# Altium schematic sheet C-07 PWR MGR.SchDoc
size 513 x 386 mm
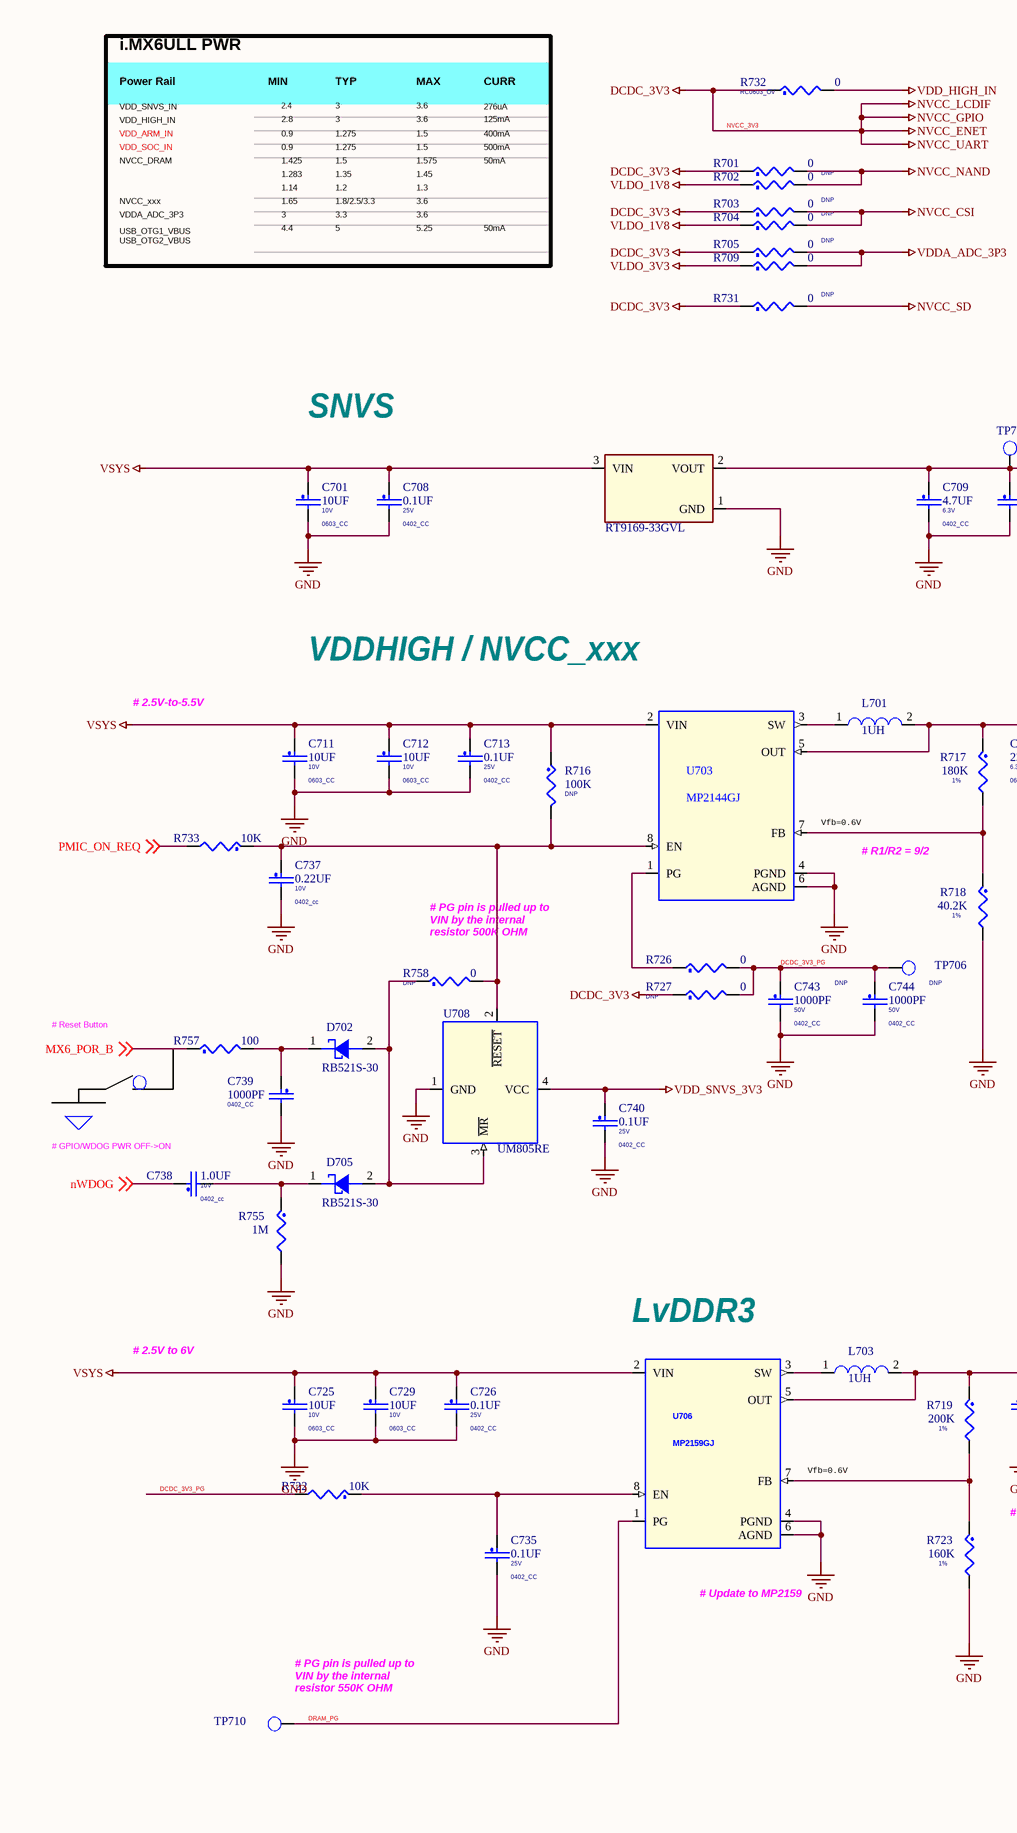
[diagram p0: C-07 PWR MGR.SchDoc, left]
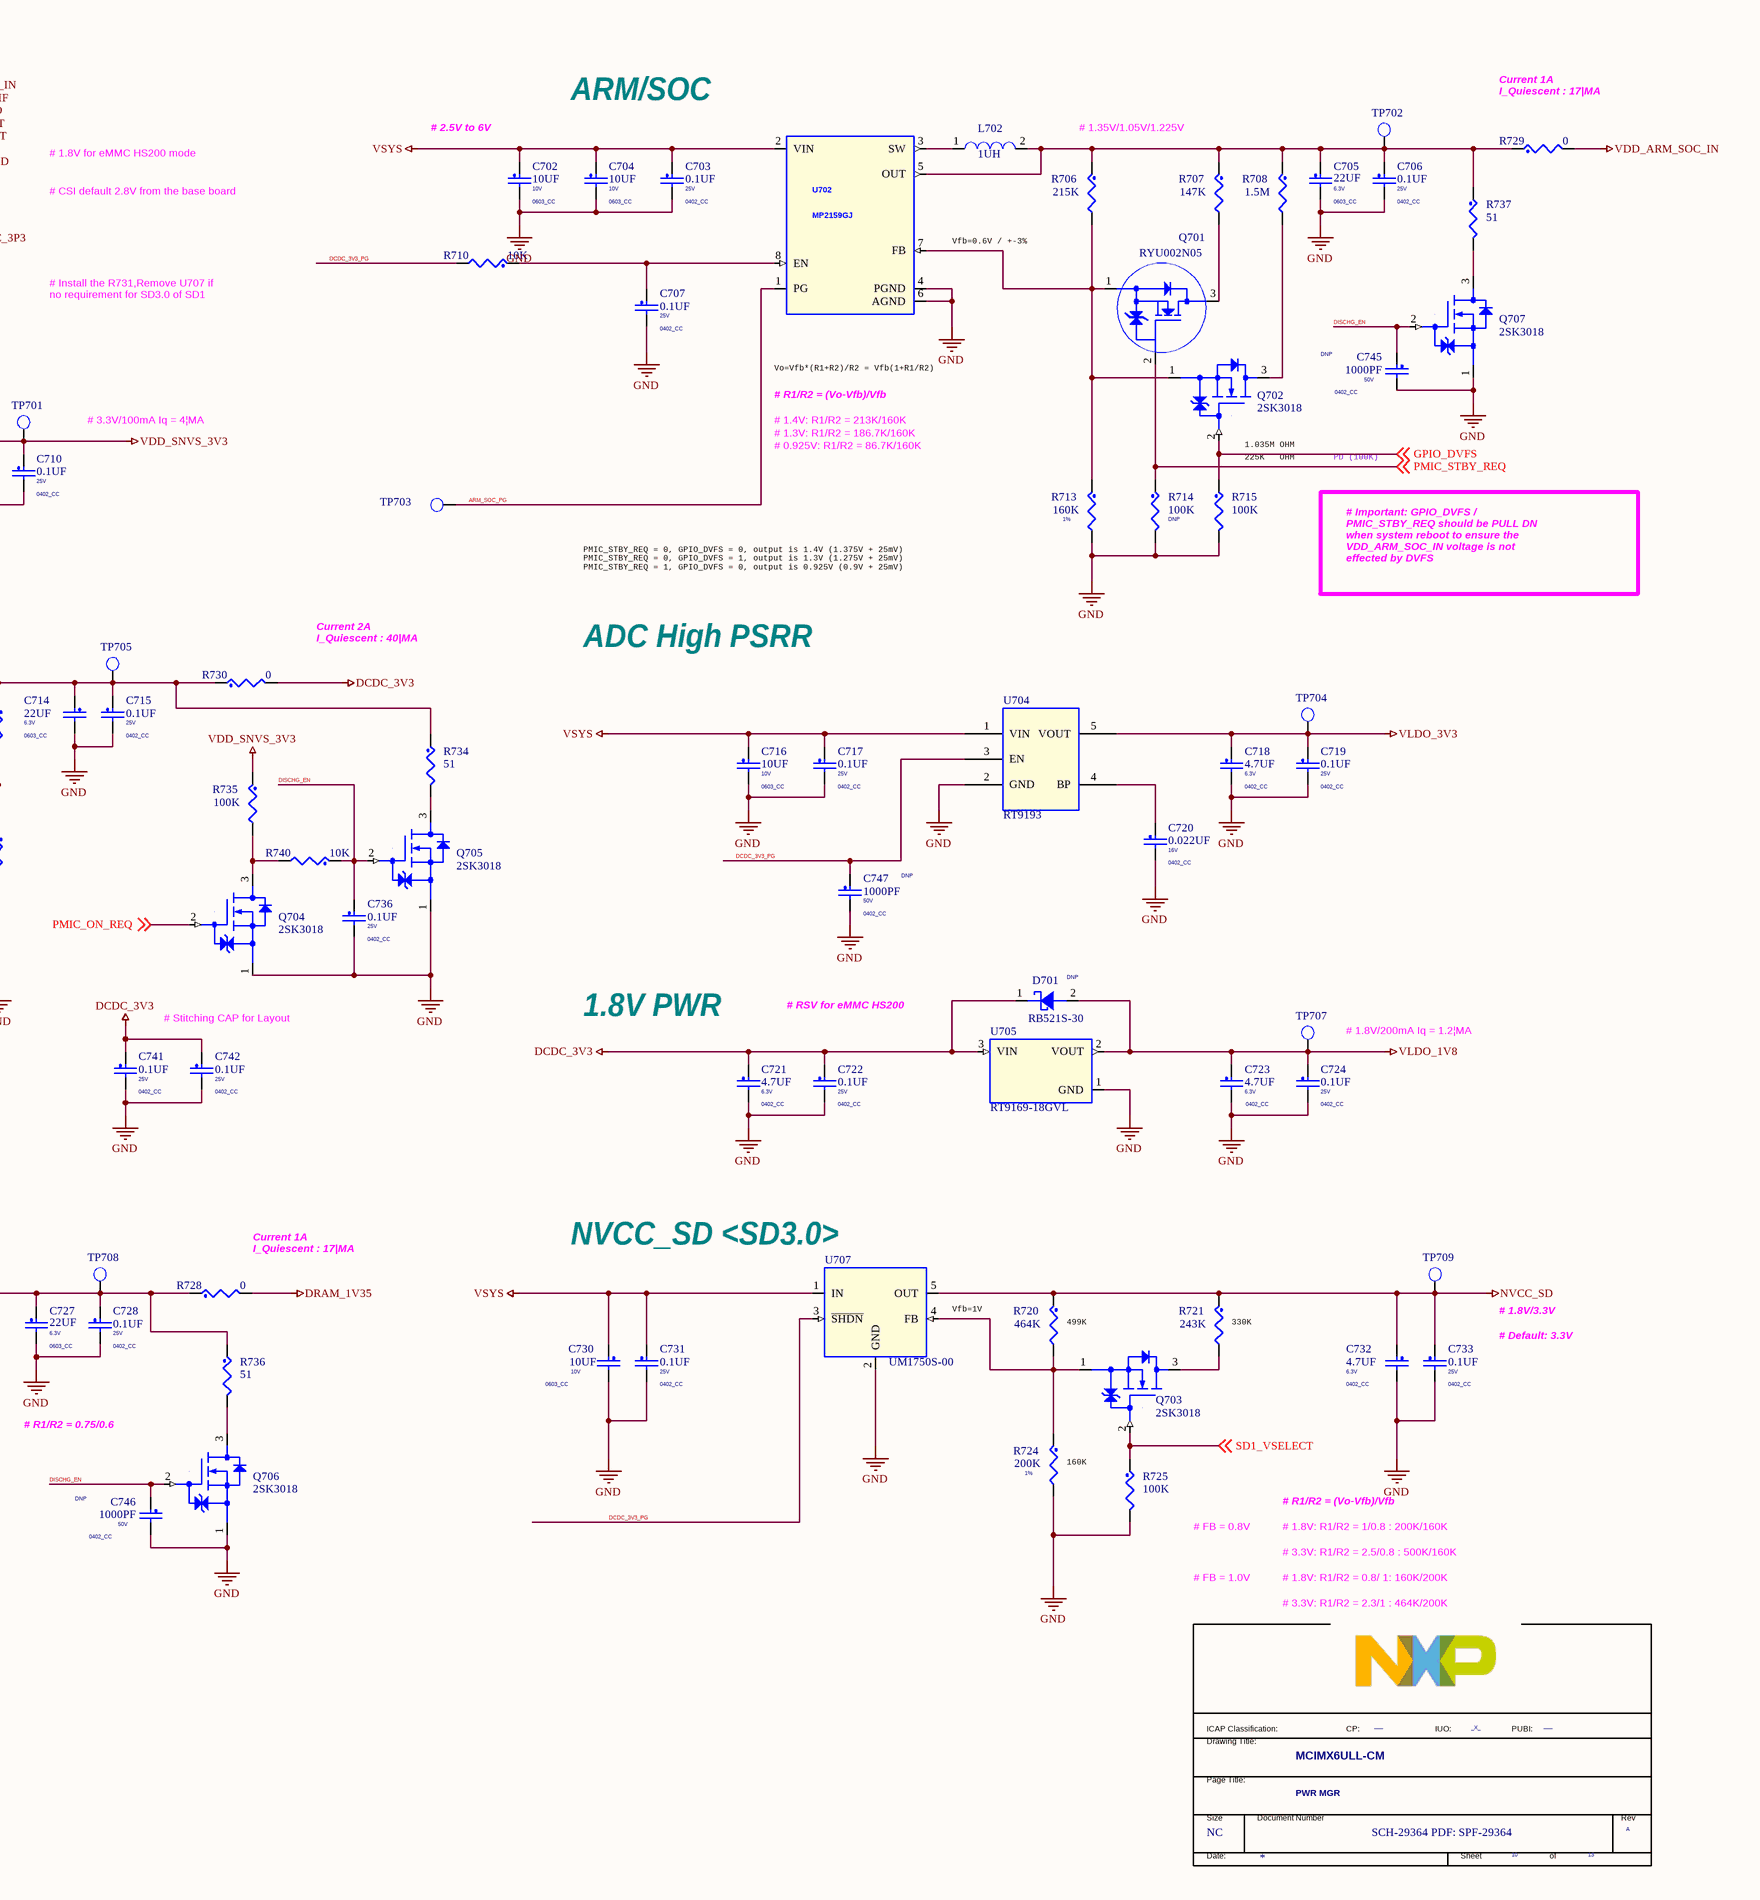
[diagram p1: C-07 PWR MGR.SchDoc, right]

## Parts
*  FIUO: _X_  PUBI: ___  Doc: SCH-29364 PDF: SPF-29364  RevCode: A  Title: MCIMX6ULL-CM  Page Size: NC  Page Number: 10  Page Count: 13  PageTitle: PWR MGR  (hidden comment: TitleBlock_FS)  (graphical)
C701  10UF  PCB Footprint: 0603_CC  VOLTAGE: 10V  [C0603_H0.8mm]
C702  10UF  PCB Footprint: 0603_CC  VOLTAGE: 10V  [C0603_H0.8mm]
C703  0.1UF  PCB Footprint: 0402_CC  VOLTAGE: 25V  [C0402_H0.5mm]
C704  10UF  PCB Footprint: 0603_CC  VOLTAGE: 10V  [C0603_H0.8mm]
C705  22UF  voltage rating: 6.3V  PCB Footprint: 0603_CC  [C0603_H0.8mm]
C706  0.1UF  PCB Footprint: 0402_CC  VOLTAGE: 25V  [C0402_H0.5mm]
C707  0.1UF  PCB Footprint: 0402_CC  VOLTAGE: 25V  [C0402_H0.5mm]
C708  0.1UF  PCB Footprint: 0402_CC  VOLTAGE: 25V  [C0402_H0.5mm]
C709  4.7UF  voltage rating: 6.3V  PCB Footprint: 0402_CC  [C0402_H0.5mm]
C710  0.1UF  PCB Footprint: 0402_CC  VOLTAGE: 25V  [C0402_H0.5mm]
C711  10UF  PCB Footprint: 0603_CC  VOLTAGE: 10V  [C0603_H0.8mm]
C712  10UF  PCB Footprint: 0603_CC  VOLTAGE: 10V  [C0603_H0.8mm]
C713  0.1UF  PCB Footprint: 0402_CC  VOLTAGE: 25V  [C0402_H0.5mm]
C714  22UF  PCB Footprint: 0603_CC  voltage rating: 6.3V  [C0603_H0.8mm]
C715  0.1UF  PCB Footprint: 0402_CC  VOLTAGE: 25V  [C0402_H0.5mm]
C716  10UF  PCB Footprint: 0603_CC  VOLTAGE: 10V  [C0603_H0.8mm]
C717  0.1UF  PCB Footprint: 0402_CC  VOLTAGE: 25V  [C0402_H0.5mm]
C718  4.7UF  voltage rating: 6.3V  PCB Footprint: 0402_CC  [C0402_H0.5mm]
C719  0.1UF  PCB Footprint: 0402_CC  VOLTAGE: 25V  [C0402_H0.5mm]
C720  0.022UF  VOLTAGE: 16V  PCB Footprint: 0402_CC  [C0402_H0.5mm]
C721  4.7UF  voltage rating: 6.3V  PCB Footprint: 0402_CC  [C0402_H0.5mm]
C722  0.1UF  PCB Footprint: 0402_CC  VOLTAGE: 25V  [C0402_H0.5mm]
C723  4.7UF  voltage rating: 6.3V  PCB Footprint: 0402_CC  [C0402_H0.5mm]
C724  0.1UF  PCB Footprint: 0402_CC  VOLTAGE: 25V  [C0402_H0.5mm]
C725  10UF  PCB Footprint: 0603_CC  VOLTAGE: 10V  [C0603_H0.8mm]
C726  0.1UF  PCB Footprint: 0402_CC  VOLTAGE: 25V  [C0402_H0.5mm]
C727  22UF  voltage rating: 6.3V  PCB Footprint: 0603_CC  [C0603_H0.8mm]
C728  0.1UF  PCB Footprint: 0402_CC  VOLTAGE: 25V  [C0402_H0.5mm]
C729  10UF  PCB Footprint: 0603_CC  VOLTAGE: 10V  [C0603_H0.8mm]
C730  10UF  PCB Footprint: 0603_CC  VOLTAGE: 10V  [C0603_H0.8mm]
C731  0.1UF  PCB Footprint: 0402_CC  VOLTAGE: 25V  [C0402_H0.5mm]
C732  4.7UF  PCB Footprint: 0402_CC  voltage rating: 6.3V  [C0402_H0.5mm]
C733  0.1UF  PCB Footprint: 0402_CC  VOLTAGE: 25V  [C0402_H0.5mm]
C735  0.1UF  PCB Footprint: 0402_CC  VOLTAGE: 25V  [C0402_H0.5mm]
C736  0.1UF  PCB Footprint: 0402_CC  VOLTAGE: 25V  [C0402_H0.5mm]
C737  0.22UF  PCB Footprint: 0402_cc  VOLTAGE: 10V  [C0402_H0.5mm]
C738  1.0UF  PCB Footprint: 0402_cc  VOLTAGE: 10V  [C0402_H0.5mm]
C739  1000PF  PCB Footprint: 0402_CC  [C0402_H0.5mm]
C740  0.1UF  PCB Footprint: 0402_CC  VOLTAGE: 25V  [C0402_H0.5mm]
C741  0.1UF  PCB Footprint: 0402_CC  VOLTAGE: 25V  [C0402_H0.5mm]
C742  0.1UF  PCB Footprint: 0402_CC  VOLTAGE: 25V  [C0402_H0.5mm]
C743  1000PF  PCB Footprint: 0402_CC  VOLTAGE: 50V  ASSY_OPT: DNP  [C0402_H0.5mm]
C744  1000PF  PCB Footprint: 0402_CC  ASSY_OPT: DNP  VOLTAGE: 50V  [C0402_H0.5mm]
C745  1000PF  PCB Footprint: 0402_CC  ASSY_OPT: DNP  VOLTAGE: 50V  [C0402_H0.5mm]
C746  1000PF  PCB Footprint: 0402_CC  ASSY_OPT: DNP  VOLTAGE: 50V  [C0402_H0.5mm]
C747  1000PF  PCB Footprint: 0402_CC  ASSY_OPT: DNP  VOLTAGE: 50V  [C0402_H0.5mm]
D701  RB521S-30  ASSY_OPT: DNP  [SOD-523_1.2x0.8mm]
D702  RB521S-30  [SOD-523_1.2x0.8mm]
D705  RB521S-30  [SOD-523_1.2x0.8mm]
L701  1UH  [SWPA4020S]
L702  1UH  [SWPA4020S]
L703  1UH  [SWPA4020S]
Q701  RYU002N05  [SOT323-3]
Q702  2SK3018  [SOT323-3]
Q703  2SK3018  [SOT323-3]
Q704  2SK3018  [SOT323-3]
Q705  2SK3018  [SOT323-3]
Q706  2SK3018  [SOT323-3]
Q707  2SK3018  [SOT323-3]
R701  0  [R0402_H0.35mm]
R702  0  ASSY_OPT: DNP  [R0402_H0.35mm]
R703  0  ASSY_OPT: DNP  [R0402_H0.35mm]
R704  0  ASSY_OPT: DNP  [R0402_H0.35mm]
R705  0  ASSY_OPT: DNP  [R0402_H0.35mm]
R706  215K  [R0402_H0.35mm]
R707  147K  [R0402_H0.35mm]
R708  1.5M  [R0402_H0.35mm]
R709  0  [R0402_H0.35mm]
R710  10K  [R0402_H0.35mm]
R713  160K  Tolerance: 1%  [R0402_H0.35mm]
R714  100K  ASSY_OPT: DNP  [R0402_H0.35mm]
R715  100K  [R0402_H0.35mm]
R716  100K  ASSY_OPT: DNP  [R0402_H0.35mm]
R717  180K  Tolerance: 1%  [R0402_H0.35mm]
R718  40.2K  Tolerance: 1%  [R0402_H0.35mm]
R719  200K  Tolerance: 1%  [R0402_H0.35mm]
R720  464K  [R0402_H0.35mm]
R721  243K  [R0402_H0.35mm]
R722  10K  [R0402_H0.35mm]
R723  160K  Tolerance: 1%  [R0402_H0.35mm]
R724  200K  Tolerance: 1%  [R0402_H0.35mm]
R725  100K  [R0402_H0.35mm]
R726  0  [R0402_H0.35mm]
R727  0  ASSY_OPT: DNP  [R0402_H0.35mm]
R728  0  [R0805_H0.5mm]
R729  0  [R0805_H0.5mm]
R730  0  [R0805_H0.5mm]
R731  0  ASSY_OPT: DNP  [R0402_H0.35mm]
R732  0  PCB Footprint: RC0603_OV  [R0603_H0.45mm]
R733  10K  [R0402_H0.35mm]
R734  51  [R0402_H0.35mm]
R735  100K  [R0402_H0.35mm]
R736  51  [R0402_H0.35mm]
R737  51  [R0402_H0.35mm]
R740  10K  [R0402_H0.35mm]
R755  1M  [R0402_H0.35mm]
R757  100  [R0402_H0.35mm]
R758  0  ASSY_OPT: DNP  [R0402_H0.35mm]
TP701  TP_35MIL  [TPAD_035]  (value not drawn)
TP702  TP_35MIL  [TPAD_035]  (value not drawn)
TP703  TP_35MIL  [TPAD_035]  (value not drawn)
TP704  TP_35MIL  [TPAD_035]  (value not drawn)
TP705  TP_35MIL  [TPAD_035]  (value not drawn)
TP706  TP_35MIL  [TPAD_035]  (value not drawn)
TP707  TP_35MIL  [TPAD_035]  (value not drawn)
TP708  TP_35MIL  [TPAD_035]  (value not drawn)
TP709  TP_35MIL  [TPAD_035]  (value not drawn)
TP710  TP_35MIL  [TPAD_035]  (value not drawn)
U701  RT9169-33GVL  [SOT23-3]
U702  MP2159GJ  [TSOT23-8_3x1.7mm]
U703  MP2144GJ  [TSOT23-8_3x1.7mm]
U704  RT9193  [sot23-5]
U705  RT9169-18GVL  [SOT23-3]
U706  MP2159GJ  [TSOT23-8_3x1.7mm]
U707  UM1750S-00  [SOT23-5]
U708  UM805RE  [SOT143]

## Nets
DRAM_1V35: R728.2
GND: C701.2 C702.2 C703.2 C704.2 C705.2 C706.2 C707.2 C708.2 C709.2 C710.2 C711.2 C712.2 C713.2 C714.2 C715.2 C716.2 C717.2 C718.2 C719.2 C720.2 C721.2 C722.2 C723.2 C724.2 C725.2 C726.2 C727.2 C728.2 C729.2 C730.2 C731.2 C732.2 C733.2 C735.2 C736.2 C737.2 C739.2 C740.2 C741.2 C742.2 C743.2 C744.2 C745.2 C746.2 C747.2 Q704.1(SOURCE) Q705.1(SOURCE) Q706.1(SOURCE) Q707.1(SOURCE) R713.2 R714.2 R715.2 R718.2 R723.2 R724.2 R725.2 R755.2 U701.1(GND) U702.4(PGND) U702.6(AGND) U703.4(PGND) U703.6(AGND) U704.2(GND) U705.1(GND) U706.4(PGND) U706.6(AGND) U707.2(GND) U708.1(GND)
NVCC_3V3: C721.1 C722.1 C741.1 C742.1 D701.1(C) R701.1 R703.1 R705.1 R727.1 R730.2 R731.1 R732.1 U705.3(VIN)  [also labelled DCDC_3V3, NVCC_ENET, NVCC_GPIO, NVCC_LCDIF, NVCC_UART]
NVCC_CSI: R703.2 R704.2
NVCC_NAND: R701.2 R702.2
NVCC_SD: C732.1 C733.1 R720.1 R721.1 R731.2 TP709.1(TP) U707.5(OUT)
VDD_ARM_SOC_IN: R729.2
VDD_HIGH_IN: R732.2
VDD_SNVS_3V3: C709.1 C710.1 C740.1 R735.1 TP701.1(TP) U701.2(VOUT) U708.4(VCC)
VDDA_ADC_3P3: R705.2 R709.2
VLDO_1V8: C723.1 C724.1 D701.2(A) R702.1 R704.1 TP707.1(TP) U705.2(VOUT)
VLDO_3V3: C718.1 C719.1 R709.1 TP704.1(TP) U704.5(VOUT)
VSYS: C701.1 C702.1 C703.1 C704.1 C708.1 C711.1 C712.1 C713.1 C716.1 C717.1 C725.1 C726.1 C729.1 C730.1 C731.1 R716.1 U701.3(VIN) U702.2(VIN) U703.2(VIN) U704.1(VIN) U706.2(VIN) U707.1(IN)
ARM_SOC_PG: TP703.1(TP) U702.1(PG)
DCDC_3V3_PG: C743.1 C744.1 C747.1 R710.2 R722.2 R726.2 R727.2 TP706.1(TP) U704.3(EN) U707.3(~{SHDN})
DISCHG_EN: C736.1 C745.1 C746.1 Q705.2(GATE) Q706.2(GATE) Q707.2(GATE) R740.1
DRAM_PG: TP710.1(TP) U706.1(PG)
GPIO_DVFS: Q702.2(GATE) R715.1 ; off-sheet GPIO_DVFS
MX6_POR_B: R757.1 ; off-sheet MX6_POR_B
nWDOG: C738.1 ; off-sheet nWDOG
PMIC_ON_REQ: Q704.2(GATE) R733.2 ; off-sheet PMIC_ON_REQ
PMIC_STBY_REQ: Q701.2(GATE) R714.1 ; off-sheet PMIC_STBY_REQ
SD1_VSELECT: Q703.2(GATE) R725.1 ; off-sheet SD1_VSELECT
NetC705_1: C705.1 C706.1 L702.2 R706.1 R707.1 R708.1 R729.1 R737.1 TP702.1(TP) U702.5(OUT)
NetC707_1: C707.1 R710.1 U702.8(EN)
NetC714_1: C714.1 C715.1 L701.2 R717.1 R730.1 R734.1 TP705.1(TP) U703.5(OUT)
NetC720_1: C720.1 U704.4(BP)
NetC727_1: C727.1 C728.1 L703.2 R719.1 R728.1 R736.1 TP708.1(TP) U706.5(OUT)
NetC735_1: C735.1 R722.1 U706.8(EN)
NetC737_1: C737.1 R716.2 R733.1 R758.2 U703.8(EN) U708.2(~{RESET})
NetC738_2: C738.2 D705.1(C) R755.1
NetC739_1: C739.1 D702.1(C) R757.2
NetD702_2: D702.2(A) D705.2(A) R758.1 U708.3(~{MR})
NetL701_1: L701.1 U703.3(SW)
NetL702_1: L702.1 U702.3(SW)
NetL703_1: L703.1 U706.3(SW)
NetQ701_1: Q701.1(SOURCE) Q702.1(SOURCE) R706.2 R713.1 U702.7(FB)
NetQ701_3: Q701.3(DRAIN) R707.2
NetQ702_3: Q702.3(DRAIN) R708.2
NetQ703_1: Q703.1(SOURCE) R720.2 R724.1 U707.4(FB)
NetQ703_3: Q703.3(DRAIN) R721.2
NetQ704_3: Q704.3(DRAIN) R735.2 R740.2
NetQ705_3: Q705.3(DRAIN) R734.2
NetQ706_3: Q706.3(DRAIN) R736.2
NetQ707_3: Q707.3(DRAIN) R737.2
NetR717_2: R717.2 R718.1 U703.7(FB)
NetR719_2: R719.2 R723.1 U706.7(FB)
NetR726_1: R726.1 U703.1(PG)

## Notes on the sheet
- i.MX6ULL PWR
- VDD_SNVS_IN
- VDD_HIGH_IN
- Power Rail
- MIN
- 2.4
- 2.8
- TYP
- 3
- MAX
- 3.6
- CURR
- 276uA
- 125mA
- ARM/SOC
- (near R729) Current 1A
  I_Quiescent : 17|МA
- VDD_SOC_IN
- VDD_ARM_IN
- NVCC_DRAM
- 0.9
- 1.425
- 1.283
- 1.14
- 1.275
- 1.5
- 1.35
- 1.2
- 1.575
- 1.45
- 1.3
- 400mA
- 500mA
- 50mA
- # 1.8V for eMMC HS200 mode
- (near C702) # 2.5V to 6V
- # 1.35V/1.05V/1.225V
- USB_OTG1_VBUS
  USB_OTG2_VBUS
- NVCC_xxx
- VDDA_ADC_3P3
- 1.65
- 4.4
- 1.8/2.5/3.3
- 3.3
- 5
- 5.25
- # CSI default 2.8V from the base board
- (near U702) Vfb=0.6V / +-3%
- # Install the R731,Remove U707 if
  no requirement for SD3.0 of SD1
- Vo=Vfb*(R1+R2)/R2 = Vfb(1+R1/R2)
- SNVS
- # 3.3V/100mA Iq = 4¦МA
- # R1/R2 = (Vo-Vfb)/Vfb
- # 1.4V: R1/R2 = 213K/160K
- # 1.3V: R1/R2 = 186.7K/160K
- # 0.925V: R1/R2 = 86.7K/160K
- (near Q702) 1.035M OHM
- 225K   OHM
- PD (100K)
- VDDHIGH / NVCC_xxx
- PMIC_STBY_REQ = 0, GPIO_DVFS = 0, output is 1.4V (1.375V + 25mV)
  PMIC_STBY_REQ = 0, GPIO_DVFS = 1, output is 1.3V (1.275V + 25mV)
  PMIC_STBY_REQ = 1, GPIO_DVFS = 0, output is 0.925V (0.9V + 25mV)
- # Important: GPIO_DVFS /
  PMIC_STBY_REQ should be PULL DN
  when system reboot to ensure the
  VDD_ARM_SOC_IN voltage is not
  effected by DVFS
- # 2.5V-to-5.5V
- Current 2A
  I_Quiescent : 40|МA
- ADC High PSRR
- (near U703) Vfb=0.6V
- # R1/R2 = 9/2
- # PG pin is pulled up to
  VIN by the internal
  resistor 500K OHM
- # Reset Button
- # RSV for eMMC HS200
- # Stitching CAP for Layout
- 1.8V PWR
- # 1.8V/200mA Iq = 1.2¦МA
- (near C738) # GPIO/WDOG PWR OFF->ON
- (near U706) LvDDR3
- (near R728) Current 1A
  I_Quiescent : 17|МA
- (near U707) NVCC_SD <SD3.0>
- # 2.5V to 6V
- (near U707) Vfb=1V
- (near R720) 499K
- (near R721) 330K
- # 1.8V/3.3V
- (near U706) Vfb=0.6V
- # Default: 3.3V
- # R1/R2 = 0.75/0.6
- # Update to MP2159
- (near R724) 160K
- # FB = 0.8V
- (near *) # FB = 1.0V
- # 1.8V: R1/R2 = 1/0.8 : 200K/160K
- # 3.3V: R1/R2 = 2.5/0.8 : 500K/160K
- # 1.8V: R1/R2 = 0.8/ 1: 160K/200K
- (near TP710) # PG pin is pulled up to
  VIN by the internal
  resistor 550K OHM
- # 3.3V: R1/R2 = 2.3/1 : 464K/200K
- (in symbol TitleBlock_FS) ICAP Classification:; CP:; IUO:; PUBI:; Drawing Title:; Page Title:; Size; Document Number; Rev; Date:; Sheet; of

## Library data of the parts
* = TitleBlock_FS: OrgAddr2: Austin, TX 78735-8598; OrgAddr1: 6501 William Cannon Drive West; OrgName: Freescale Semiconductor; FCP: ___; Page Create Date: March  8, 1995; Page Modify Date: *
C701 C702 C704 C711 C712 C716 C725 C729 C730 = CAP_NP: CAP CER 10UF 10V 20% X5R 0603; CLASS: DISCRETE; AGILE_PN: 150-78609; MFG_NAME01: TAIYO YUDEN; MFG_PN01: LMK107BJ106MALTD; CAD_APPROVED: Yes; FPLIST: CC0603_OV,CC0603,0603_CC; ROHS: Yes; HEIGHT: 1.016MM
C703 C710 C713 C717 C724 C726 C728 C735 C740 C742 = CAP_NP: CAP CER 0.1UF 25V 10% X5R 0402; CLASS: DISCRETE; AGILE_PN: 150-78633; MFG_NAME01: YAGEO AMERICA; MFG_PN01: CC0402KRX5R8BB104; CAD_APPROVED: Yes; FPLIST: CC0402_25,CC0402_HD,0402_CC; Tolerance: 10%; ROHS: Yes; HEIGHT: 0.55MM
C705 C714 C727 = CAP_NP: CAP CER 22UF 6.3V 20% X5R 0603; CLASS: DISCRETE; AGILE_PN: 150-78467; MFG_NAME01: Samsung; MFG_PN01: CL10A226MQ8NRNE; CAD_APPROVED: Yes; FPLIST: CC0603_OV,CC0603,0603_CC; Tolerance: 20%; ROHS: Yes; HEIGHT: 1MM; VOLTAGE: 6.3V
C706-C708 C715 C719 C722 C731 C733 C736 C741 = CAP_NP: CAP CER 0.1UF 25V 10% X5R 0402; CLASS: DISCRETE; FPLIST: CC0402_25,CC0402_HD,0402_CC; CAD_APPROVED: Yes; MFG_PN01: CC0402KRX5R8BB104; MFG_NAME01: YAGEO AMERICA; AGILE_PN: 150-78633; HEIGHT: 0.55MM; ROHS: Yes; Tolerance: 10%
C709 C721 C732 = CAP_NP: CAP CER 4.7UF 6.3V 20% X5R 0402; CLASS: DISCRETE; AGILE_PN: 150-78463; MFG_NAME01: VENKEL COMPANY; MFG_PN01: C0402X5R6R3-475MNP; CAD_APPROVED: Yes; FPLIST: CC0402_25,CC0402_HD,0402_CC; VOLTAGE: 6.3V; Tolerance: 20%; ROHS: Yes; HEIGHT: 0.65MM
C718 C723 = CAP_NP: CAP CER 4.7UF 6.3V 20% X5R 0402; CLASS: DISCRETE; FPLIST: CC0402_25,CC0402_HD,0402_CC; CAD_APPROVED: Yes; MFG_PN01: C0402X5R6R3-475MNP; MFG_NAME01: VENKEL COMPANY; AGILE_PN: 150-78463; HEIGHT: 0.65MM; ROHS: Yes; Tolerance: 20%; VOLTAGE: 6.3V
C720 = CAP_NP: CAP CER 0.022UF 16V 10% X7R 0402; CLASS: DISCRETE; AGILE_PN: 150-30293; MFG_NAME01: AVX; MFG_PN01: 0402YC223KAT2A; CAD_APPROVED: Yes; FPLIST: CC0402_25,CC0402_HD,0402_CC; Tolerance: 10%; ROHS: Yes; HEIGHT: 0.56MM
C737 = CAP_NP: CAP CER 0.22UF 10V 10% X5R 0402; CLASS: DISCRETE; AGILE_PN: 150-77358; MFG_NAME01: MURATA; MFG_PN01: GRM155R61A224KE19B; CAD_APPROVED: Yes; FPLIST: CC0402_25,CC0402_HD,0402_CC; Tolerance: 10%; ROHS: Yes; HEIGHT: 0.55MM
C738 = CAP_NP: CAP CER 1.0UF 10V 10% X5R 0402; CLASS: DISCRETE; FPLIST: CC0402_25,CC0402_HD,0402_CC; CAD_APPROVED: Yes; MFG_PN01: CC0402KRX5R6BB105; MFG_NAME01: YAGEO AMERICA; AGILE_PN: 150-75772; HEIGHT: 0.6MM; ROHS: Yes
C739 C744-C747 = CAP_NP: CAP CER 1000PF 50V 5% C0G 0402; CLASS: DISCRETE; AGILE_PN: 150-76334; MFG_NAME01: MURATA; MFG_PN01: GRM1555C1H102JA01D; CAD_APPROVED: Yes; FPLIST: CC0402_25,CC0402_HD,0402_CC; Tolerance: 5%; ROHS: Yes; HEIGHT: 0.55MM
  C739: VOLTAGE: 50V
C743 = CAP_NP: CAP CER 1000PF 50V 5% C0G 0402; CLASS: DISCRETE; FPLIST: CC0402_25,CC0402_HD,0402_CC; CAD_APPROVED: Yes; MFG_PN01: GRM1555C1H102JA01D; MFG_NAME01: MURATA; AGILE_PN: 150-76334; HEIGHT: 0.55MM; ROHS: Yes; Tolerance: 5%
D701 = DIODE_SCHTKY: DIODE SCH 200MA 30V SOD-523; CLASS: IC; AGILE_PN: 480-75983; MFG_NAME01: ROHM; MFG_PN01: RB521S-30TE61; CAD_APPROVED: Yes; PCB Footprint: SOD523; ROHS: Yes; HEIGHT: 0.7MM
D702 = DIODE_SCHTKY: DIODE SCH 200MA 30V SOD-523; CLASS: IC; PCB Footprint: SOD523; AGILE_PN: 480-75983; MFG_NAME01: ROHM; MFG_PN01: RB521S-30TE61; CAD_APPROVED: Yes; ROHS: Yes; HEIGHT: 0.7MM
D705 = DIODE_SCHTKY: DIODE SCH 200MA 30V SOD-523; CLASS: IC; PCB Footprint: SOD523; CAD_APPROVED: Yes; MFG_PN01: RB521S-30TE61; MFG_NAME01: ROHM; AGILE_PN: 480-75983; HEIGHT: 0.7MM; ROHS: Yes
L701-L703 = IND: IND PWR 1UH@100KHZ 2.6A 30% SMT; CLASS: DISCRETE; PCB Footprint: ind_4020; CAD_APPROVED: Yes; MFG_PN01: SWPA4020S1R0NT; MFG_NAME01: Shenzhen Sunlord Electronics Co., Ltd; AGILE_PN: 180-77797; HEIGHT: 2.2MM; ROHS: Yes; TOL: 30%
Q701 = NMOSFET_3P_ESD_DIODE: TRAN NMOS SW 0.9V DRIVE 50V UMT3; CLASS: IC; PCB Footprint: SOT323_3; CAD_APPROVED: Yes; MFG_NAME01: ROHM; AGILE_PN: 480-78966; HEIGHT: 0.9MM; ROHS: Yes; MFG_PN01: RYU002N05
Q702 Q703 Q707 = 2SK3018: TRANS MOSFET N-CH 30V .1A SOT-323; CLASS: IC; CAD_APPROVED: Yes; MFG_PN01: 2SK3018T106; MFG_NAME01: ROHM; AGILE_PN: 480-75317; PCB Footprint: SOT323_3; HEIGHT: 0.9MM; ROHS: Yes
Q704 = 2SK3018: TRANS MOSFET N-CH 30V .1A SOT-323; CLASS: IC; PCB Footprint: SOT323_3; AGILE_PN: 480-75317; MFG_NAME01: ROHM; MFG_PN01: 2SK3018T106; CAD_APPROVED: Yes; ROHS: Yes; HEIGHT: 0.9MM
Q705 = 2SK3018: TRANS MOSFET N-CH 30V .1A SOT-323; CLASS: IC; PCB Footprint: SOT323_3; CAD_APPROVED: Yes; MFG_PN01: 2SK3018T106; MFG_NAME01: ROHM; AGILE_PN: 480-75317; HEIGHT: 0.9MM; ROHS: Yes
Q706 = 2SK3018: TRANS MOSFET N-CH 30V .1A SOT-323; CLASS: IC; AGILE_PN: 480-75317; MFG_NAME01: ROHM; MFG_PN01: 2SK3018T106; CAD_APPROVED: Yes; PCB Footprint: SOT323_3; ROHS: Yes; HEIGHT: 0.9MM
R701-R703 R709 = RES: RES MF ZERO OHM 1/16W 5% 0402; CLASS: DISCRETE; AGILE_PN: 470-75394; MFG_NAME01: ROHM; MFG_PN01: MCR01MZPJ000; CAD_APPROVED: Yes; FPLIST: RC0402_25,RC0402_HD,RC0402_X2,0402_CC; PCB Footprint: 0402_CC; Tolerance: 5%; ROHS: Yes
R704 R705 R731 = RES: RES MF ZERO OHM 1/16W 5% 0402; CLASS: DISCRETE; FPLIST: RC0402_25,RC0402_HD,RC0402_X2,0402_CC; CAD_APPROVED: Yes; MFG_PN01: MCR01MZPJ000; MFG_NAME01: ROHM; AGILE_PN: 470-75394; PCB Footprint: 0402_CC; ROHS: Yes; Tolerance: 5%
R706 = RES: RES MF 215K  1/16W 1% 0402; CLASS: DISCRETE; PCB Footprint: 0402_CC; AGILE_PN: 470-31096; MFG_NAME01: KOA SPEER; MFG_PN01: RK73H1ETTP2153F; CAD_APPROVED: Yes; FPLIST: RC0402_25,RC0402_HD,0402_CC; Tolerance: 1%; ROHS: Yes; HEIGHT: 0.40 MM
R707 = RES: RES MF 147K  1/16W 1% 0402; CLASS: DISCRETE; PCB Footprint: 0402_CC; AGILE_PN: 470-31078; MFG_NAME01: KOA SPEER; MFG_PN01: RK73H1ETTP1473F; CAD_APPROVED: Yes; FPLIST: RC0402_25,RC0402_HD,0402_CC; Tolerance: 1%; ROHS: Yes; HEIGHT: 0.40 MM
R708 = RES: RES MF 1.5M  1/16W 1% 0402; CLASS: DISCRETE; PCB Footprint: 0402_CC; AGILE_PN: 470-31192; MFG_NAME01: KOA SPEER; MFG_PN01: RK73H1ETTP1504F; CAD_APPROVED: Yes; FPLIST: RC0402_25,RC0402_HD,0402_CC; Tolerance: 1%; ROHS: Yes; HEIGHT: 0.40 MM
R710 R733 R740 = RES: RES MF 10K 1/16W 5% 0402; CLASS: DISCRETE; PCB Footprint: 0402_CC; AGILE_PN: 470-75557; MFG_NAME01: VISHAY INTERTECHNOLOGY; MFG_PN01: CRCW040210K0JNED; CAD_APPROVED: Yes; FPLIST: RC0402_25,RC0402_HD,0402_CC; Tolerance: 5%; ROHS: Yes
R713 R723 = RES: RES MF 160K  1/16W 1% 0402; CLASS: DISCRETE; FPLIST: RC0402_25,RC0402_HD,0402_CC; CAD_APPROVED: Yes; MFG_PN01: RK73H1ETTP1603F; MFG_NAME01: KOA SPEER; AGILE_PN: 470-31082; PCB Footprint: 0402_CC; ROHS: Yes
R714 R715 R725 = RES: RES MF 100K 1/16W 5% 0402; CLASS: DISCRETE; FPLIST: RC0402_25,RC0402_HD,0402_CC; CAD_APPROVED: Yes; MFG_PN01: RK73B1ETTP104J; MFG_NAME01: KOA SPEER; AGILE_PN: 470-75597; PCB Footprint: 0402_CC; ROHS: Yes; Tolerance: 5%
R716 = RES: RES MF 100K 1/16W 5% 0402; CLASS: DISCRETE; PCB Footprint: 0402_CC; AGILE_PN: 470-75597; MFG_NAME01: KOA SPEER; MFG_PN01: RK73B1ETTP104J; CAD_APPROVED: Yes; FPLIST: RC0402_25,RC0402_HD,0402_CC; Tolerance: 5%; ROHS: Yes
R717 = RES: RES MF 180K  1/16W 1% 0402; CLASS: DISCRETE; PCB Footprint: 0402_CC; AGILE_PN: 470-31088; MFG_NAME01: KOA SPEER; MFG_PN01: RK73H1ETTP1803F; CAD_APPROVED: Yes; FPLIST: RC0402_25,RC0402_HD,0402_CC; ROHS: Yes
R718 = RES: RES MF 40.2K  1/16W 1% 0402; CLASS: DISCRETE; PCB Footprint: 0402_CC; FPLIST: RC0402_25,RC0402_HD,0402_CC; CAD_APPROVED: Yes; MFG_PN01: RK73H1ETTP4022F; MFG_NAME01: KOA SPEER; AGILE_PN: 470-31015; ROHS: Yes
R719 = RES: RES MF 200K  1/16W 1% 0402; CLASS: DISCRETE; FPLIST: RC0402_25,RC0402_HD,0402_CC; CAD_APPROVED: Yes; MFG_PN01: RK73H1ETTP2003F; MFG_NAME01: KOA SPEER; AGILE_PN: 470-31093; PCB Footprint: 0402_CC; ROHS: Yes
R720 = RES: RES MF 464K  1/16W 1% 0402; CLASS: DISCRETE; PCB Footprint: 0402_CC; AGILE_PN: 470-31135; MFG_NAME01: KOA SPEER; MFG_PN01: RK73H1ETTP4643F; CAD_APPROVED: Yes; FPLIST: RC0402_25,RC0402_HD,0402_CC; Tolerance: 1%; ROHS: Yes
R721 = RES: RES MF 243K  1/16W 1% 0402; CLASS: DISCRETE; PCB Footprint: 0402_CC; AGILE_PN: 470-31102; MFG_NAME01: KOA SPEER; MFG_PN01: RK73H1ETTP2433F; CAD_APPROVED: Yes; FPLIST: RC0402_25,RC0402_HD,0402_CC; Tolerance: 1%; ROHS: Yes
R722 = RES: RES MF 10K 1/16W 5% 0402; CLASS: DISCRETE; PCB Footprint: 0402_CC; FPLIST: RC0402_25,RC0402_HD,0402_CC; CAD_APPROVED: Yes; MFG_PN01: CRCW040210K0JNED; MFG_NAME01: VISHAY INTERTECHNOLOGY; AGILE_PN: 470-75557; ROHS: Yes; Tolerance: 5%
R724 = RES: RES MF 200K  1/16W 1% 0402; CLASS: DISCRETE; PCB Footprint: 0402_CC; FPLIST: RC0402_25,RC0402_HD,0402_CC; CAD_APPROVED: Yes; MFG_PN01: RK73H1ETTP2003F; MFG_NAME01: KOA SPEER; AGILE_PN: 470-31093; ROHS: Yes
R726 R758 = RES: RES MF ZERO OHM 1/16W 5% 0402; CLASS: DISCRETE; PCB Footprint: 0402_CC; AGILE_PN: 470-75394; MFG_NAME01: ROHM; MFG_PN01: MCR01MZPJ000; CAD_APPROVED: Yes; FPLIST: RC0402_25,RC0402_HD,RC0402_X2,0402_CC; Tolerance: 5%; ROHS: Yes
R727 = RES: RES MF ZERO OHM 1/16W 5% 0402; CLASS: DISCRETE; PCB Footprint: 0402_CC; FPLIST: RC0402_25,RC0402_HD,RC0402_X2,0402_CC; CAD_APPROVED: Yes; MFG_PN01: MCR01MZPJ000; MFG_NAME01: ROHM; AGILE_PN: 470-75394; ROHS: Yes; Tolerance: 5%
R728 = RES: RES MF ZERO OHM 1/8W -- 0805; CLASS: DISCRETE; AGILE_PN: 470-75442; Tolerance: 5%; MFG_NAME01: YAGEO AMERICA; MFG_PN01: RC0805JR-070RL; CAD_APPROVED: Yes; FPLIST: RC0805_OV,RC0805,RC0805_OV_3P,0805_CC; PCB Footprint: RC0805_OV; ROHS: Yes
R729 R730 = RES: RES MF ZERO OHM 1/8W -- 0805; CLASS: DISCRETE; FPLIST: RC0805_OV,RC0805,RC0805_OV_3P,0805_CC; CAD_APPROVED: Yes; MFG_PN01: RC0805JR-070RL; MFG_NAME01: YAGEO AMERICA; Tolerance: 5%; AGILE_PN: 470-75442; PCB Footprint: RC0805_OV; ROHS: Yes
R732 = RES: RES MF ZERO OHM 1/10W -- 0603; CLASS: DISCRETE; AGILE_PN: 470-80866; MFG_NAME01: BOURNS; MFG_PN01: CR0603J/000ELF; FPLIST: RC0603_OV,RC0603,R603-X2,0603_CC; ROHS: Yes
R734 = RES: RES MF 51 OHM 1/16W 1% 0402; CLASS: DISCRETE; PCB Footprint: 0402_CC; FPLIST: RC0402_25,RC0402_HD,0402_CC; CAD_APPROVED: Yes; MFG_PN01: CRCW040251R0FKED; MFG_NAME01: VISHAY INTERTECHNOLOGY; AGILE_PN: 470-30164; ROHS: Yes; Tolerance: 1%
R735 = RES: RES MF 100K 1/16W 5% 0402; CLASS: DISCRETE; PCB Footprint: 0402_CC; FPLIST: RC0402_25,RC0402_HD,0402_CC; CAD_APPROVED: Yes; MFG_PN01: RK73B1ETTP104J; MFG_NAME01: KOA SPEER; AGILE_PN: 470-75597; ROHS: Yes; Tolerance: 5%
R736 R737 = RES: RES MF 51 OHM 1/16W 1% 0402; CLASS: DISCRETE; AGILE_PN: 470-30164; MFG_NAME01: VISHAY INTERTECHNOLOGY; MFG_PN01: CRCW040251R0FKED; CAD_APPROVED: Yes; FPLIST: RC0402_25,RC0402_HD,0402_CC; PCB Footprint: 0402_CC; Tolerance: 1%; ROHS: Yes
R755 = RES: RES MF 1.0M 1/10W 5% 0402; CLASS: DISCRETE; PCB Footprint: 0402_CC; FPLIST: RC0402_25,RC0402_HD,0402_CC; CAD_APPROVED: Yes; MFG_PN01: ERJ-2GEJ105X; MFG_NAME01: PANASONIC; AGILE_PN: 470-79978; ROHS: Yes; Tolerance: 5%
R757 = RES: RES MF 100 OHM 1/16W 1% 0402; CLASS: DISCRETE; PCB Footprint: 0402_CC; FPLIST: RC0402_25,RC0402_HD,0402_CC; CAD_APPROVED: Yes; MFG_PN01: CR-02FL6--100R; MFG_NAME01: THYE MING TECH CO LTD; AGILE_PN: 470-30454; ROHS: Yes; Tolerance: 1%
TP701 TP702 TP704 = T POINT R: TEST POINT PAD .035 SMT, no part to order; CLASS: IC; CAD_APPROVED: Yes; AGILE_PN: 510-75618; PCB Footprint: testpoint_35mil; HEIGHT: 0.1MM; ROHS: Yes
TP703 TP706 TP710 = T POINT R: TEST POINT PAD .035 SMT, no part to order; CLASS: IC; PCB Footprint: testpoint_35mil; AGILE_PN: 510-75618; CAD_APPROVED: Yes; ROHS: Yes; HEIGHT: 0.1MM
TP705 TP709 = T POINT R: TEST POINT PAD .035 SMT, no part to order; CLASS: IC; PCB Footprint: testpoint_35mil; CAD_APPROVED: Yes; AGILE_PN: 510-75618; HEIGHT: 0.1MM; ROHS: Yes
TP707 TP708 = T POINT R: TEST POINT PAD .035 SMT, no part to order; CLASS: IC; AGILE_PN: 510-75618; CAD_APPROVED: Yes; PCB Footprint: testpoint_35mil; ROHS: Yes; HEIGHT: 0.1MM
U701 = RT9169_3P: IC VREG LDO 3.3V 100mA 2-6V SOT-23-3; CAD_APPROVED: Yes; MFG_NAME01: Richtek; AGILE_PN: 315-80510; PCB Footprint: sot23-3-1p95; CLASS: IC; HEIGHT: 1.295MM; ROHS: Yes; MFG_PN01: RT9169-33GVL
U702 U706 = MP2159GJ_8P: IC VREG SYNC SW 0.6V 1A 2.5-6V TSOT23-8; AGILE_PN: 315-80519; MFG_NAME01: MONOLITHIC POWER SYSTEMS; CAD_APPROVED: Yes; PCB Footprint: tsot23_8_0p65_2x1; CLASS: IC; MFG_PN01: MP2159GJ; ROHS: Yes; HEIGHT: 1MM
U703 = MP2144GJ_TSOT23_8P: IC SYNC STEP-DOWN SW 1.2MHZ 0.6V 2A 2.5-5.5V TSOT23-8; PCB Footprint: tsot23_8_0p65_2x1; CAD_APPROVED: Yes; MFG_NAME01: MONOLITHIC POWER SYSTEMS; AGILE_PN: 315-80508; CLASS: IC; HEIGHT: 1MM; ROHS: Yes; MFG_PN01: MP2144GJ
U704 = RT9193-33PB: IC VREG LDO 3.3V 300MA SOT-23-5; CAD_APPROVED: Yes; MFG_NAME01: RICHTEK; AGILE_PN: 315-76265; CLASS: IC; HEIGHT: 1.295MM; ROHS: Yes; MFG_PN01: RT9193-33PB; PCB Footprint: sot23-5
U705 = RT9169_3P: IC VREG LDO 1.8V 100mA 2-6V SOT-23-3; AGILE_PN: 315-80514; MFG_NAME01: Richtek; CAD_APPROVED: Yes; PCB Footprint: sot23-3-1p95; CLASS: IC; MFG_PN01: RT9169-18GVL; ROHS: Yes; HEIGHT: 1.295MM
U707 = UM1750S-00_5P: IC VREG LDO ADJ 1-5V 350mA 2.5-6V SOT23-5; CAD_APPROVED: Yes; MFG_NAME01: Union Semiconductor, Inc; AGILE_PN: 315-80554; PCB Footprint: sot23-5_a; CLASS: IC; HEIGHT: 1.25MM; ROHS: Yes; MFG_PN01: UM1750S-00
U708 = UM805_4P: IC VOLT MONITOR 2.63V VTH RST 1-5.5V SOT143; CAD_APPROVED: Yes; MFG_NAME01: Union Semiconductor, Inc; AGILE_PN: 315-80564; PCB Footprint: sot_143; CLASS: IC; HEIGHT: 1.22MM; ROHS: Yes; MFG_PN01: UM805RE